# EAGLE schematic main_schematic (EAGLE 7.1.0)
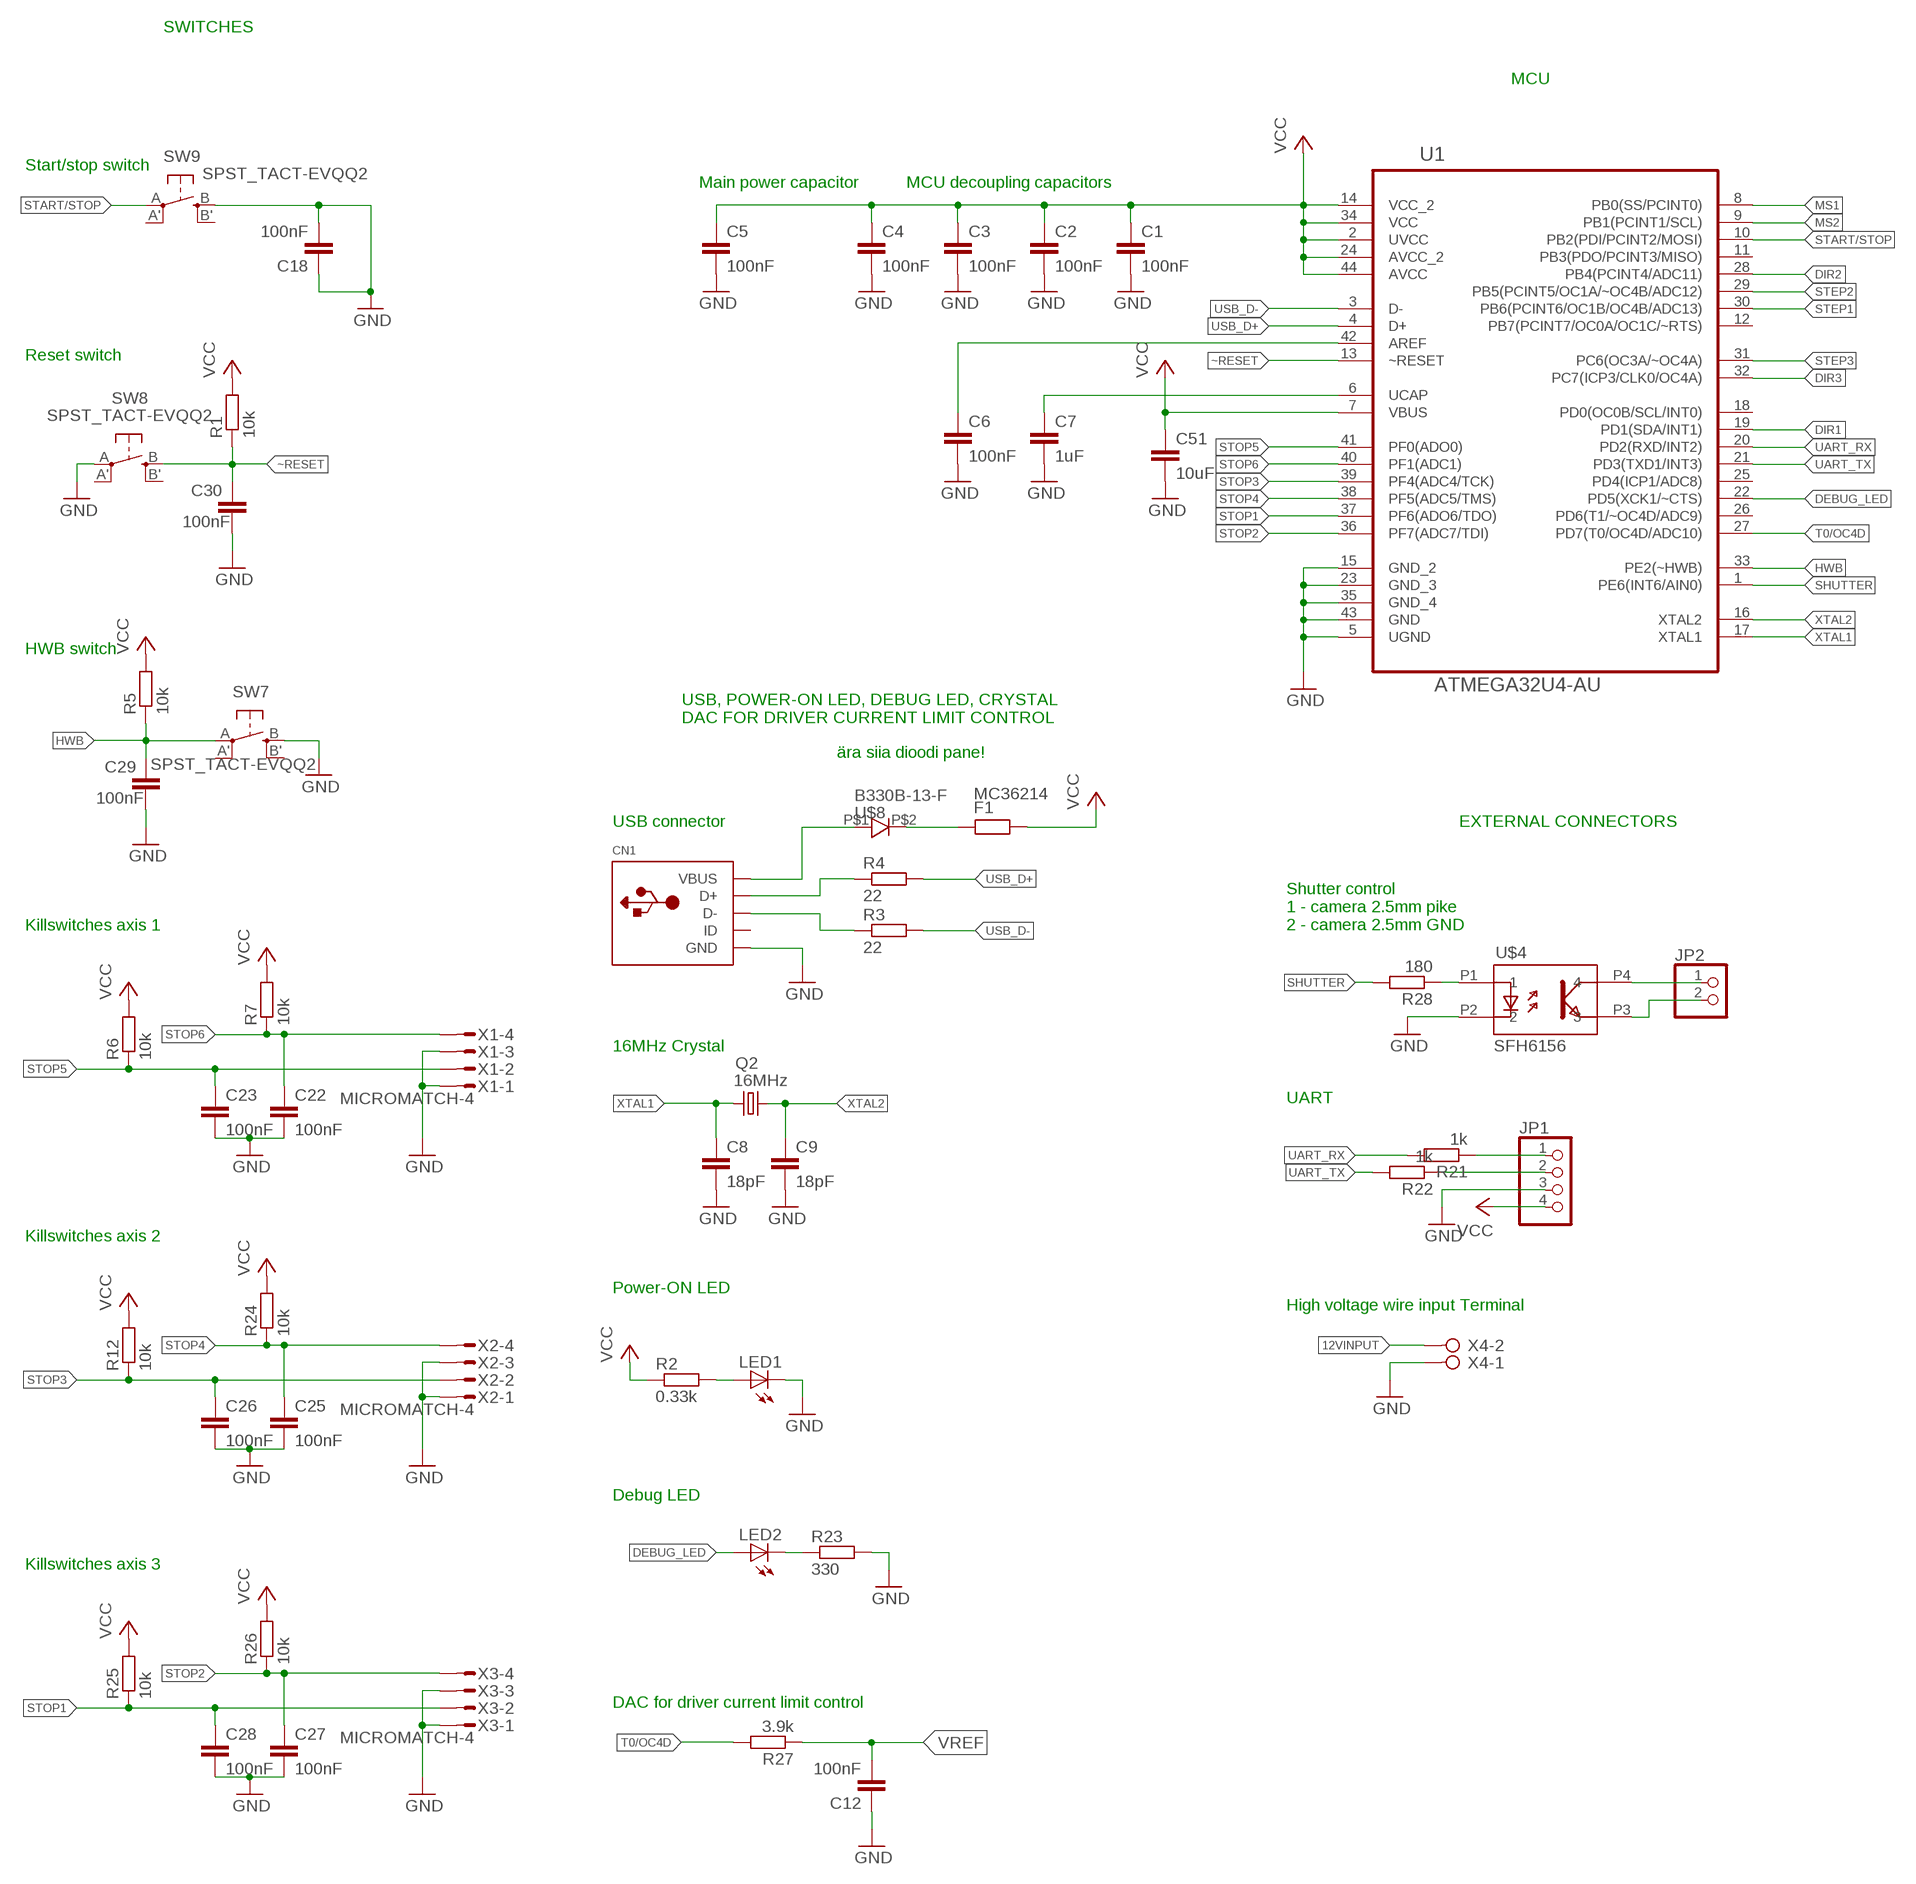
[diagram p0: schematic, sheet 1, part 1 of 2]
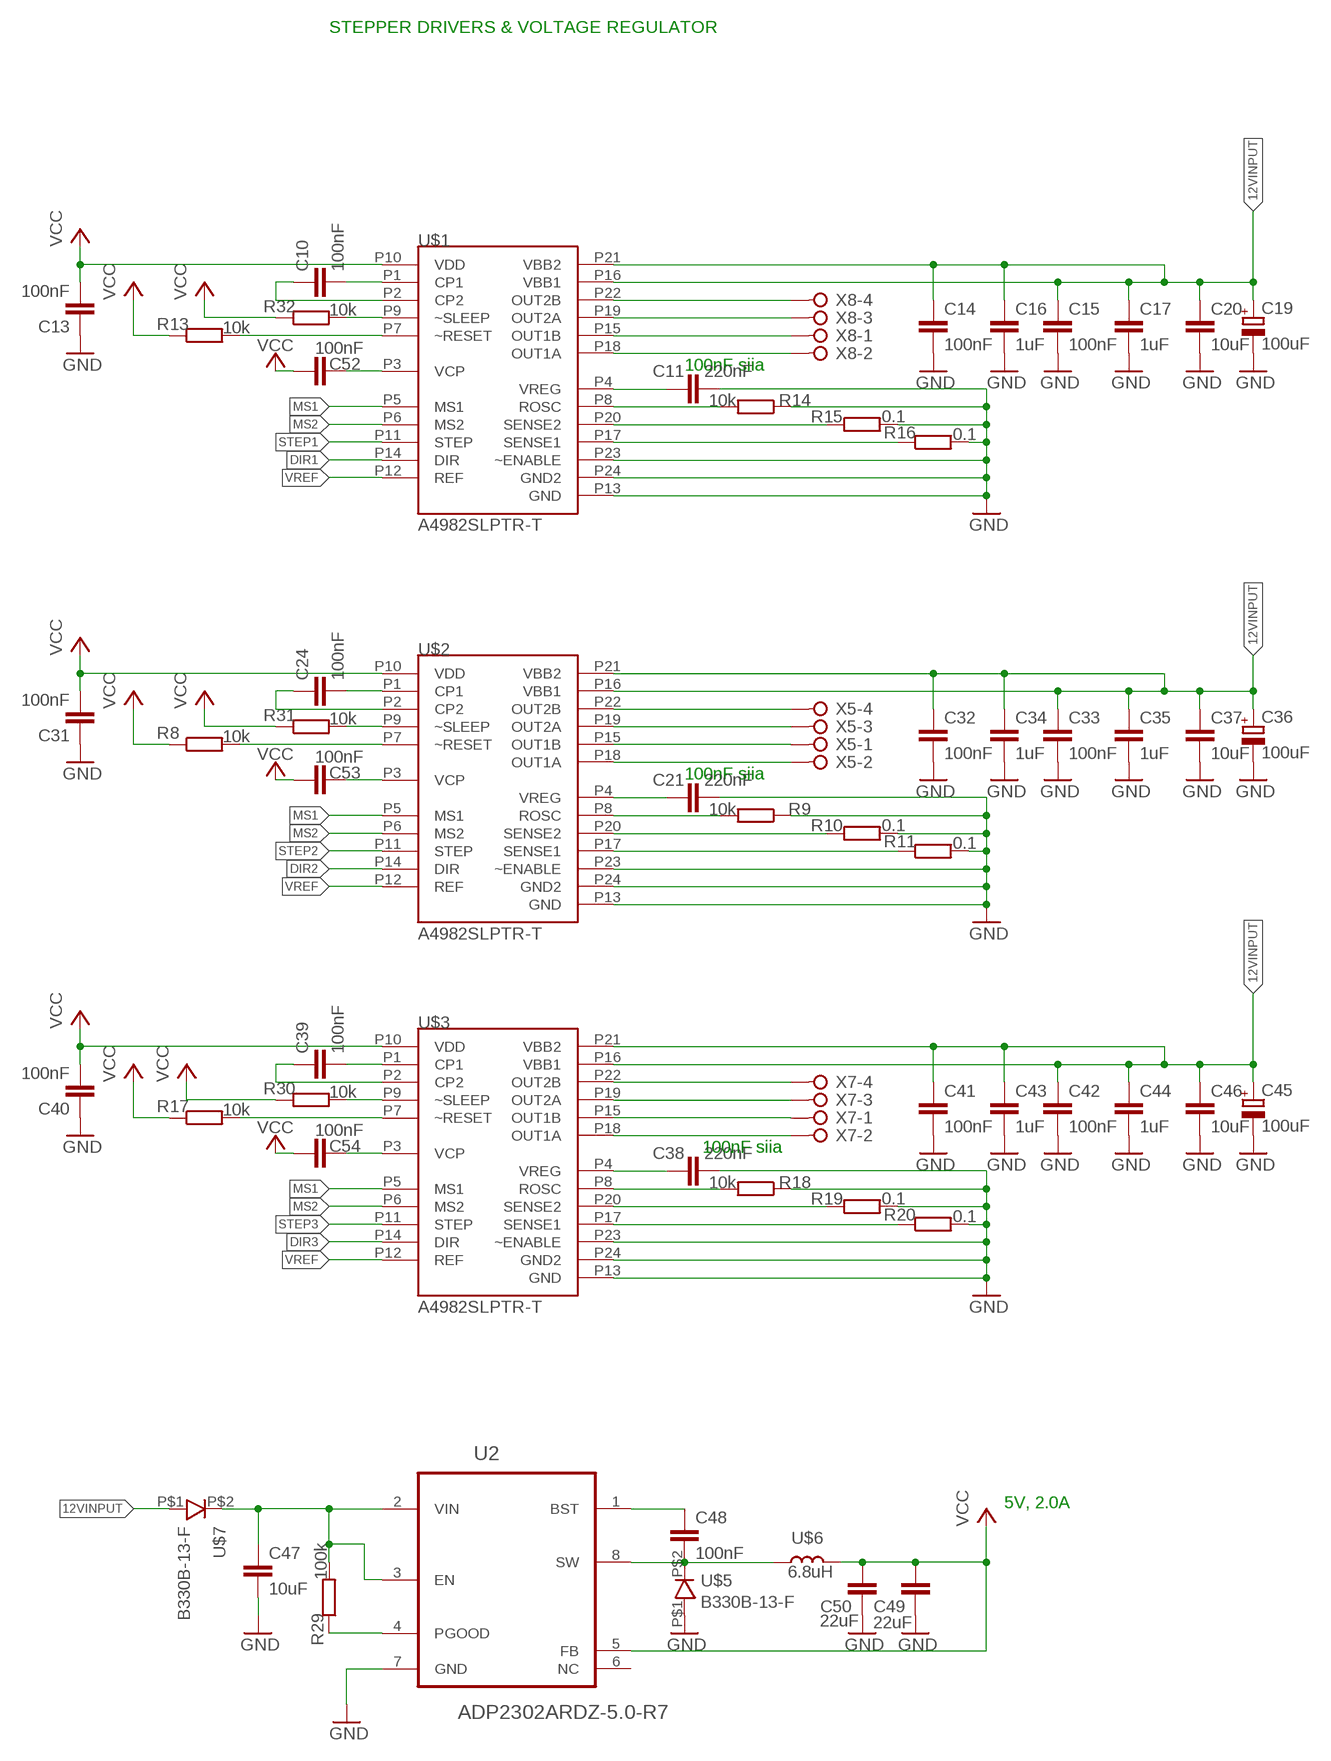
[diagram p1: schematic, sheet 1, part 2 of 2]

## Parts
C1  100nF  C-EUC0603K  [C0603K]
C2  100nF  C-EUC0603K  [C0603K]
C3  100nF  C-EUC0603K  [C0603K]
C4  100nF  C-EUC0603K  [C0603K]
C5  100nF  C-EUC0603K  [C0603K]
C6  100nF  C-EUC0603K  [C0603K]
C7  1uF  C-EUC0603K  [C0603K]
C8  18pF  C-EUC0603K  [C0603K]
C9  18pF  C-EUC0603K  [C0603K]
C10  100nF  C-EUC0603K  [C0603K]
C11  220nF  C-EUC0603K  [C0603K]
C12  100nF  C-EUC0603K  [C0603K]
C13  100nF  C-EUC0603K  [C0603K]
C14  100nF  C-EUC0603K  [C0603K]
C15  100nF  C-EUC0603K  [C0603K]
C16  1uF  C-EUC0603K  [C0603K]
C17  1uF  C-EUC0603K  [C0603K]
C18  100nF  C-EUC0603K  [C0603K]
C19  100uF  CPOL-EUE/7260-38R  [E/7260-38R]
C20  10uF  C-EUC1206K  [C1206K]
C21  220nF  C-EUC0603K  [C0603K]
C22  100nF  C-EUC0603K  [C0603K]
C23  100nF  C-EUC0603K  [C0603K]
C24  100nF  C-EUC0603K  [C0603K]
C25  100nF  C-EUC0603K  [C0603K]
C26  100nF  C-EUC0603K  [C0603K]
C27  100nF  C-EUC0603K  [C0603K]
C28  100nF  C-EUC0603K  [C0603K]
C29  100nF  C-EUC0603K  [C0603K]
C30  100nF  C-EUC0603K  [C0603K]
C31  100nF  C-EUC0603K  [C0603K]
C32  100nF  C-EUC0603K  [C0603K]
C33  100nF  C-EUC0603K  [C0603K]
C34  1uF  C-EUC0603K  [C0603K]
C35  1uF  C-EUC0603K  [C0603K]
C36  100uF  CPOL-EUE/7260-38R  [E/7260-38R]
C37  10uF  C-EUC1206K  [C1206K]
C38  220nF  C-EUC0603K  [C0603K]
C39  100nF  C-EUC0603K  [C0603K]
C40  100nF  C-EUC0603K  [C0603K]
C41  100nF  C-EUC0603K  [C0603K]
C42  100nF  C-EUC0603K  [C0603K]
C43  1uF  C-EUC0603K  [C0603K]
C44  1uF  C-EUC0603K  [C0603K]
C45  100uF  CPOL-EUE/7260-38R  [E/7260-38R]
C46  10uF  C-EUC1206K  [C1206K]
C47  10uF  C-EUC1206K  [C1206K]
C48  100nF  C-EUC1206K  [C1206K]
C49  22uF  C-EUC1206K  [C1206K]
C50  22uF  C-EUC1206K  [C1206K]
C51  10uF  C-EUC0805  [C0805]
C52  100nF  C-EUC0603K  [C0603K]
C53  100nF  C-EUC0603K  [C0603K]
C54  100nF  C-EUC0603K  [C0603K]
CN1  USBMINIB  [USB-MINIB]
F1  MC36214  [MC36214]
JP1  PINHD-1X4  [1X04]
JP2  PINHD-1X2  [1X02]
LED1  LEDCHIP-LED0603  [CHIP-LED0603]
LED2  LEDCHIP-LED0603  [CHIP-LED0603]
Q2  16MHz  CRYSTALSM49  [SM49]
R1  10k  R-EU_R0603  [R0603]
R2  0.33k  R-EU_R0603  [R0603]
R3  22  R-EU_R0603  [R0603]
R4  22  R-EU_R0603  [R0603]
R5  10k  R-EU_R0603  [R0603]
R6  10k  R-EU_R0603  [R0603]
R7  10k  R-EU_R0603  [R0603]
R8  10k  R-EU_R0603  [R0603]
R9  10k  R-EU_R0603  [R0603]
R10  0.1  R-EU_R0805  [R0805]
R11  0.1  R-EU_R0805  [R0805]
R12  10k  R-EU_R0603  [R0603]
R13  10k  R-EU_R0603  [R0603]
R14  10k  R-EU_R0603  [R0603]
R15  0.1  R-EU_R0805  [R0805]
R16  0.1  R-EU_R0805  [R0805]
R17  10k  R-EU_R0603  [R0603]
R18  10k  R-EU_R0603  [R0603]
R19  0.1  R-EU_R0805  [R0805]
R20  0.1  R-EU_R0805  [R0805]
R21  1k  R-EU_R0603  [R0603]
R22  1k  R-EU_R0603  [R0603]
R23  330  R-EU_R0603  [R0603]
R24  10k  R-EU_R0603  [R0603]
R25  10k  R-EU_R0603  [R0603]
R26  10k  R-EU_R0603  [R0603]
R27  3.9k  R-EU_R0603  [R0603]
R28  180  R-EU_R0603  [R0603]
R29  100k  R-EU_R0603  [R0603]
R30  10k  R-EU_R0603  [R0603]
R31  10k  R-EU_R0603  [R0603]
R32  10k  R-EU_R0603  [R0603]
SW7  SPST_TACT-EVQQ2  [EVQ-Q2]
SW8  SPST_TACT-EVQQ2  [EVQ-Q2]
SW9  SPST_TACT-EVQQ2  [EVQ-Q2]
U1  ATMEGA32U4-AU  [QFP80P1200X1200X120-44N]
U2  ADP2302ARDZ-5.0-R7  [SOIC127P600X175-9N]
U$1  A4982SLPTR-T  [TSSOP_24]
U$2  A4982SLPTR-T  [TSSOP_24]
U$3  A4982SLPTR-T  [TSSOP_24]
U$4  SFH6156  [SFH6165]
U$5  B330B-13-F  SCHOTTK_YB330B-13-F  [B330B-13-F]
U$6  6.8uH  VLF10040  [VLF10040]
U$7  B330B-13-F  SCHOTTK_YB330B-13-F  [B330B-13-F]
U$8  B330B-13-F  SCHOTTK_YB330B-13-F  [B330B-13-F]
X1  MICROMATCH-4  [MICROMATCH-4]
X2  MICROMATCH-4  [MICROMATCH-4]
X3  MICROMATCH-4  [MICROMATCH-4]
X4  W237-02P  [W237-132]
X5  W237-04P  [W237-4P]
X7  W237-04P  [W237-4P]
X8  W237-04P  [W237-4P]

## Nets
12VINPUT: C14.1 C15.1 C16.1 C17.1 C19.+ C20.1 C32.1 C33.1 C34.1 C35.1 C36.+ C37.1 C41.1 C42.1 C43.1 C44.1 C45.+ C46.1 U$1.P16(VBB1) U$1.P21(VBB2) U$2.P16(VBB1) U$2.P21(VBB2) U$3.P16(VBB1) U$3.P21(VBB2) U$7.P$1 X4.2
DEBUG_LED: LED2.A U1.22(PD5(XCK1/~CTS))
DIR1: U1.19(PD1(SDA/INT1)) U$1.P14(DIR)
DIR2: U1.28(PB4(PCINT4/ADC11)) U$2.P14(DIR)
DIR3: U1.32(PC7(ICP3/CLK0/OC4A)) U$3.P14(DIR)
GND: C1.2 C2.2 C3.2 C4.2 C5.2 C6.2 C7.2 C8.2 C9.2 C11.1 C12.1 C13.1 C14.2 C15.2 C16.2 C17.2 C18.1 C18.2 C19.- C20.2 C21.1 C22.2 C23.2 C25.2 C26.2 C27.2 C28.2 C29.2 C30.2 C31.1 C32.2 C33.2 C34.2 C35.2 C36.- C37.2 C38.1 C40.1 C41.2 C42.2 C43.2 C44.2 C45.- C46.2 C47.2 C49.1 C50.1 C51.2 CN1.GND JP1.3 LED1.C R9.1 R10.2 R11.2 R14.1 R15.2 R16.2 R18.1 R19.2 R20.2 R23.2 SW7.B(S) SW8.A(P) SW9.B(S) U1.5(UGND) U1.15(GND_2) U1.23(GND_3) U1.35(GND_4) U1.43(GND) U2.7(GND) U$1.P13(GND) U$1.P23(~ENABLE) U$1.P24(GND2) U$2.P13(GND) U$2.P23(~ENABLE) U$2.P24(GND2) U$3.P13(GND) U$3.P23(~ENABLE) U$3.P24(GND2) U$4.P2 U$5.P$1 X1.1 X1.3 X2.1 X2.3 X3.1 X3.3 X4.1
HIGH_VOLTAEG: C47.1 R29.2 U2.2(VIN) U2.3(EN) U$7.P$2
HWB: C29.1 R5.1 SW7.A(P) U1.33(PE2(~HWB))
MS1: U1.8(PB0(SS/PCINT0)) U$1.P5(MS1) U$2.P5(MS1) U$3.P5(MS1)
MS2: U1.9(PB1(PCINT1/SCL)) U$1.P6(MS2) U$2.P6(MS2) U$3.P6(MS2)
N$1: JP2.1 U$4.P4
N$2: C6.1 U1.42(AREF)
N$3: LED1.A R2.2
N$4: CN1.D- R3.1
N$5: CN1.D+ R4.1
N$6: C10.2 U$1.P1(CP1)
N$7: C10.1 U$1.P2(CP2)
N$8: U$1.P15(OUT1B) X8.1
N$9: U$1.P22(OUT2B) X8.4
N$10: C11.2 U$1.P4(VREG)
N$11: C7.1 U1.6(UCAP)
N$12: R13.2 U$1.P7(~RESET)
N$13: C24.2 U$2.P1(CP1)
N$14: R14.2 U$1.P8(ROSC)
N$15: R15.1 U$1.P20(SENSE2)
N$16: R16.1 U$1.P17(SENSE1)
N$17: C24.1 U$2.P2(CP2)
N$18: U$1.P19(OUT2A) X8.3
N$19: R10.1 U$2.P20(SENSE2)
N$20: U$1.P18(OUT1A) X8.2
N$21: R11.1 U$2.P17(SENSE1)
N$22: U$2.P22(OUT2B) X5.4
N$23: U$2.P15(OUT1B) X5.1
N$24: U$2.P19(OUT2A) X5.3
N$25: U$2.P18(OUT1A) X5.2
N$26: C21.2 U$2.P4(VREG)
N$27: R8.2 U$2.P7(~RESET)
N$28: R9.2 U$2.P8(ROSC)
N$29: C39.2 U$3.P1(CP1)
N$30: C39.1 U$3.P2(CP2)
N$31: R19.1 U$3.P20(SENSE2)
N$32: R20.1 U$3.P17(SENSE1)
N$33: U$3.P22(OUT2B) X7.4
N$34: U$3.P15(OUT1B) X7.1
N$35: U$3.P19(OUT2A) X7.3
N$36: U$3.P18(OUT1A) X7.2
N$37: C38.2 U$3.P4(VREG)
N$38: R17.2 U$3.P7(~RESET)
N$39: CN1.VBUS U$8.P$1
N$40: JP1.1 R21.1
N$41: JP1.2 R22.1
N$42: JP2.2 U$4.P3
N$43: R18.2 U$3.P8(ROSC)
N$44: LED2.C R23.1
N$45: R29.1 U2.4(PGOOD)
N$47: C48.1 U2.1(BST)
N$48: R28.1 U$4.P1
N$49: F1.P$1 U$8.P$2
N$50: C52.1 U$1.P3(VCP)
N$51: C48.2 U2.8(SW) U$5.P$2 U$6.P$2
N$52: C53.1 U$2.P3(VCP)
N$53: C54.1 U$3.P3(VCP)
N$78: R30.2 U$3.P9(~SLEEP)
N$95: R31.2 U$2.P9(~SLEEP)
N$98: R32.2 U$1.P9(~SLEEP)
SHUTTER: R28.2 U1.1(PE6(INT6/AIN0))
START/STOP: SW9.A(P) U1.10(PB2(PDI/PCINT2/MOSI))
STEP1: U1.30(PB6(PCINT6/OC1B/OC4B/ADC13)) U$1.P11(STEP)
STEP2: U1.29(PB5(PCINT5/OC1A/~OC4B/ADC12)) U$2.P11(STEP)
STEP3: U1.31(PC6(OC3A/~OC4A)) U$3.P11(STEP)
STOP1: C28.1 R25.1 U1.37(PF6(ADO6/TDO)) X3.2
STOP2: C27.1 R26.1 U1.36(PF7(ADC7/TDI)) X3.4
STOP3: C26.1 R12.1 U1.39(PF4(ADC4/TCK)) X2.2
STOP4: C25.1 R24.1 U1.38(PF5(ADC5/TMS)) X2.4
STOP5: C23.1 R6.1 U1.41(PF0(ADO0)) X1.2
STOP6: C22.1 R7.1 U1.40(PF1(ADC1)) X1.4
T0/OC4D: R27.2 U1.27(PD7(T0/OC4D/ADC10))
UART_RX: R21.2 U1.20(PD2(RXD/INT2))
UART_TX: R22.2 U1.21(PD3(TXD1/INT3))
USB_D+: R4.2 U1.4(D+)
USB_D-: R3.2 U1.3(D-)
VCC: C1.1 C2.1 C3.1 C4.1 C5.1 C13.2 C31.2 C40.2 C49.2 C50.2 C51.1 C52.2 C53.2 C54.2 F1.P$2 JP1.4 R1.2 R2.1 R5.2 R6.2 R7.2 R8.1 R12.2 R13.1 R17.1 R24.2 R25.2 R26.2 R30.1 R31.1 R32.1 U1.2(UVCC) U1.7(VBUS) U1.14(VCC_2) U1.24(AVCC_2) U1.34(VCC) U1.44(AVCC) U2.5(FB) U$1.P10(VDD) U$2.P10(VDD) U$3.P10(VDD) U$6.P$1
VREF: C12.2 R27.1 U$1.P12(REF) U$2.P12(REF) U$3.P12(REF)
XTAL1: C8.1 Q2.1 U1.17(XTAL1)
XTAL2: C9.1 Q2.2 U1.16(XTAL2)
~RESET: C30.1 R1.1 SW8.B(S) U1.13(~RESET)
Unconnected: CN1.ID SW7.A'(P1) SW7.B'(S1) SW8.A'(P1) SW8.B'(S1) SW9.A'(P1) SW9.B'(S1) U1.11(PB3(PDO/PCINT3/MISO)) U1.12(PB7(PCINT7/OC0A/OC1C/~RTS)) U1.18(PD0(OC0B/SCL/INT0)) U1.25(PD4(ICP1/ADC8)) U1.26(PD6(T1/~OC4D/ADC9)) U2.6(NC)

## Notes on the sheet
- STEPPER DRIVERS & VOLTAGE REGULATOR
- SWITCHES
- MCU
- Start/stop switch
- Main power capacitor | MCU decoupling capacitors
- 100nF siia
- Reset switch
- HWB switch
- USB, POWER-ON LED, DEBUG LED, CRYSTAL
  DAC FOR DRIVER CURRENT LIMIT CONTROL
- 100nF siia
- ära siia dioodi pane!
- USB connector | EXTERNAL CONNECTORS
- Killswitches axis 1
- Shutter control
  1 - camera 2.5mm pike
  2 - camera 2.5mm GND
- 16MHz Crystal
- 100nF siia
- UART
- Killswitches axis 2
- Power-ON LED
- High voltage wire input Terminal
- 5V, 2.0A
- Debug LED
- Killswitches axis 3
- DAC for driver current limit control

## Library data of the parts
C1-C18 C20-C35 C37-C44 C46-C54 = rcl:C-EU: CAPACITOR, European symbol
C19 C36 C45 = rcl:CPOL-EU: POLARIZED CAPACITOR, European symbol
CN1 = adafruit:USB: USB Connectors USBMINIB - Surface Mount Female Mini-B USB Connector 4UConnector: 06564 By microbuilder.eu Thru-hole RA Female Mini-B USB Connector 4UConnector: 18732 By ladyada.net
F1 = PTC:MC36214
JP1 = pinhead:PINHD-1X4: PIN HEADER
JP2 = pinhead:PINHD-1X2: PIN HEADER
LED1 LED2 = adafruit:LED: LED OSRAM: - CHIPLED LG R971, LG N971, LY N971, LG Q971, LY Q971, LO R971, LY R971 LH N974, LH R974 LS Q976, LO Q976, LY Q976 LO Q996 - Hyper CHIPLED LW Q18S LB Q993, LB Q99A, LB R99A - SideLED LS A670, LO A670, LY A670, LG A670, LP A670 LB A673, LV A673, LT A673, LW A673 LH A674 LY A675 LS A676, LA A676, LO A676, LY A676, LW A676 LS A679, LY A679, LG A679 - Hyper Micro SIDELED® LS Y876, LA Y876, LO Y876, LY Y876 LT Y87S - SmartLED LW L88C, LW L88S LB L89C, LB L89S, LG L890 LS L89K, LO L89K, LY L89K LS L896, LA L896, LO L896, LY L896 - TOPLED LS T670, LO T670, LY T670, LG T670, LP T670 LSG T670, LSP T670, LSY T670, LOP T670, LYG T670 LG T671, LOG T671, LSG T671 LB T673, LV T673, LT T673, LW T673 LH T674 LS T676, LA T676, LO T676, LY T676, LB T676, LH T676, LSB T676, LW T676 LB T67C, LV T67C, LT T67C, LS T67K, LO T67K, LY T67K, LW E67C LS E67B, LA E67B, LO E67B, LY E67B, LB E67C, LV E67C, LT E67C LW T67C LS T679, LY T679, LG T679 LS T770, LO T770, LY T770, LG T770, LP T770 LB T773, LV T773, LT T773, LW T773 LH T774 LS E675, LA E675, LY E675, LS T675 LS T776, LA T776, LO T776, LY T776, LB T776 LHGB T686 LT T68C, LB T68C - Hyper Mini TOPLED® LB M676 - Mini TOPLED Santana® LG M470 LS M47K, LO M47K, LY M47K Source: http://www.osram.convergy.de/
Q2 = crystal:CRYSTAL: CRYSTAL; OC_FARNELL: unknown; OC_NEWARK: unknown
R1-R32 = rcl:R-EU_: RESISTOR, European symbol
SW7-SW9 = adafruit:SPST_TACT: SMT 6mm switch, EVQQ2 series http://www.ladyada.net/library/eagle
U1 = ATmega32U4:ATMEGA32U4-AU: 8-bit Microcontroller with ISP Flash and USB Controller; MPN: ATMEGA32U4-AU; OC_FARNELL: 1748525; OC_NEWARK: 26R5633; PACKAGE: TQFP-44; SUPPLIER: Atmel
U2 = ADP2302ARDZ-5.0-R7:ADP2302ARDZ-5.0-R7: Step-Down Regulators; MPN: ADP2302ARDZ-5.0-R7; OC_FARNELL: 2312892; OC_NEWARK: 67W2704; PACKAGE: SOIC-8; SUPPLIER: Analog Devices
U$1-U$3 = Allegro_A4982_driver:A4982SLPTR-T
U$4 = SFH6156:SFH6156
U$5 U$7 U$8 = schottky_B330B-13-F:SCHOTTK_YB330B-13-F
U$6 = InductorVLF10040:VLF10040
X1-X3 = con-amp-micromatch:MICROMATCH-4: MicroMaTch 4 7-215464-4 / 0-215464-4 Drawing Number C-215464 DDEController.pdf; MPN: 7-215464-4; OC_FARNELL: 3784629; OC_NEWARK: 19R8124
X4 = con-wago-508:W237-02P: WAGO SREW CLAMP; OC_FARNELL: unknown; OC_NEWARK: unknown
X5 X7 X8 = con-wago-508:W237-04P: WAGO SREW CLAMP; OC_FARNELL: unknown; OC_NEWARK: unknown